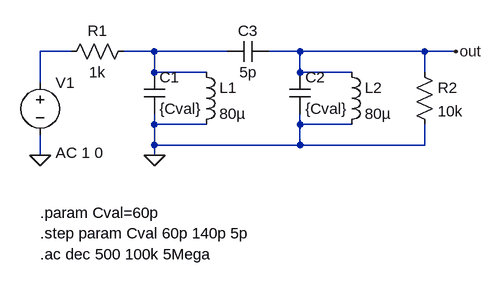
[diagram p0: schematic preselector.asc]
preselector.asc, the LTspice schematic file:
Version 4.1
SHEET 1 1020 680
WIRE 0 32 -48 32
WIRE 128 32 80 32
WIRE 240 32 128 32
WIRE 352 32 304 32
WIRE 544 32 352 32
WIRE 592 32 544 32
WIRE 128 64 128 32
WIRE 208 64 128 64
WIRE 352 64 352 32
WIRE 432 64 352 64
WIRE 544 64 544 32
WIRE -48 80 -48 32
WIRE 128 144 128 128
WIRE 208 144 128 144
WIRE 352 144 352 128
WIRE 432 144 352 144
WIRE 128 176 128 144
WIRE 352 176 352 144
WIRE 352 176 128 176
WIRE 544 176 544 144
WIRE 544 176 352 176
WIRE -48 192 -48 160
WIRE 128 192 128 176
FLAG 128 192 0
FLAG -48 192 0
FLAG 592 32 out
SYMBOL voltage -48 64 R0
WINDOW 123 24 124 Left 2
WINDOW 39 0 0 Left 0
SYMATTR Value2 AC 1 0
SYMATTR InstName V1
SYMATTR Value ""
SYMBOL cap 112 64 R0
SYMATTR InstName C1
SYMATTR Value {Cval}
SYMBOL ind 192 48 R0
SYMATTR InstName L1
SYMATTR Value 80µ
SYMATTR SpiceLine Rser=1m
SYMBOL cap 336 64 R0
SYMATTR InstName C2
SYMATTR Value {Cval}
SYMBOL ind 416 48 R0
SYMATTR InstName L2
SYMATTR Value 80µ
SYMATTR SpiceLine Rser=1m
SYMBOL res 96 16 R90
WINDOW 0 0 56 VBottom 2
WINDOW 3 32 56 VTop 2
SYMATTR InstName R1
SYMATTR Value 1k
SYMBOL res 528 48 R0
SYMATTR InstName R2
SYMATTR Value 10k
SYMBOL cap 304 16 R90
WINDOW 0 0 32 VBottom 2
WINDOW 3 32 32 VTop 2
SYMATTR InstName C3
SYMATTR Value 5p
TEXT -48 280 Left 2 !.param Cval=60p
TEXT -48 312 Left 2 !.step param Cval 60p 140p 5p
TEXT -48 344 Left 2 !.ac dec 500 100k 5Mega

The netlist it stands for:
* preselector.asc
V1 N001 0 AC 1 0
C1 N002 0 {Cval}
L1 N002 0 80µ Rser=1m
C2 out 0 {Cval}
L2 out 0 80µ Rser=1m
R1 N002 N001 1k
R2 out 0 10k
C3 out N002 5p
.param Cval=60p
.step param Cval 60p 140p 5p
.ac dec 500 100k 5Mega
.backanno
.end